# Altium schematic sheet BLOCK_DIAGRAM.SchDoc
size 393 x 281 mm; SheetNumber: 1; SheetTotal: 6
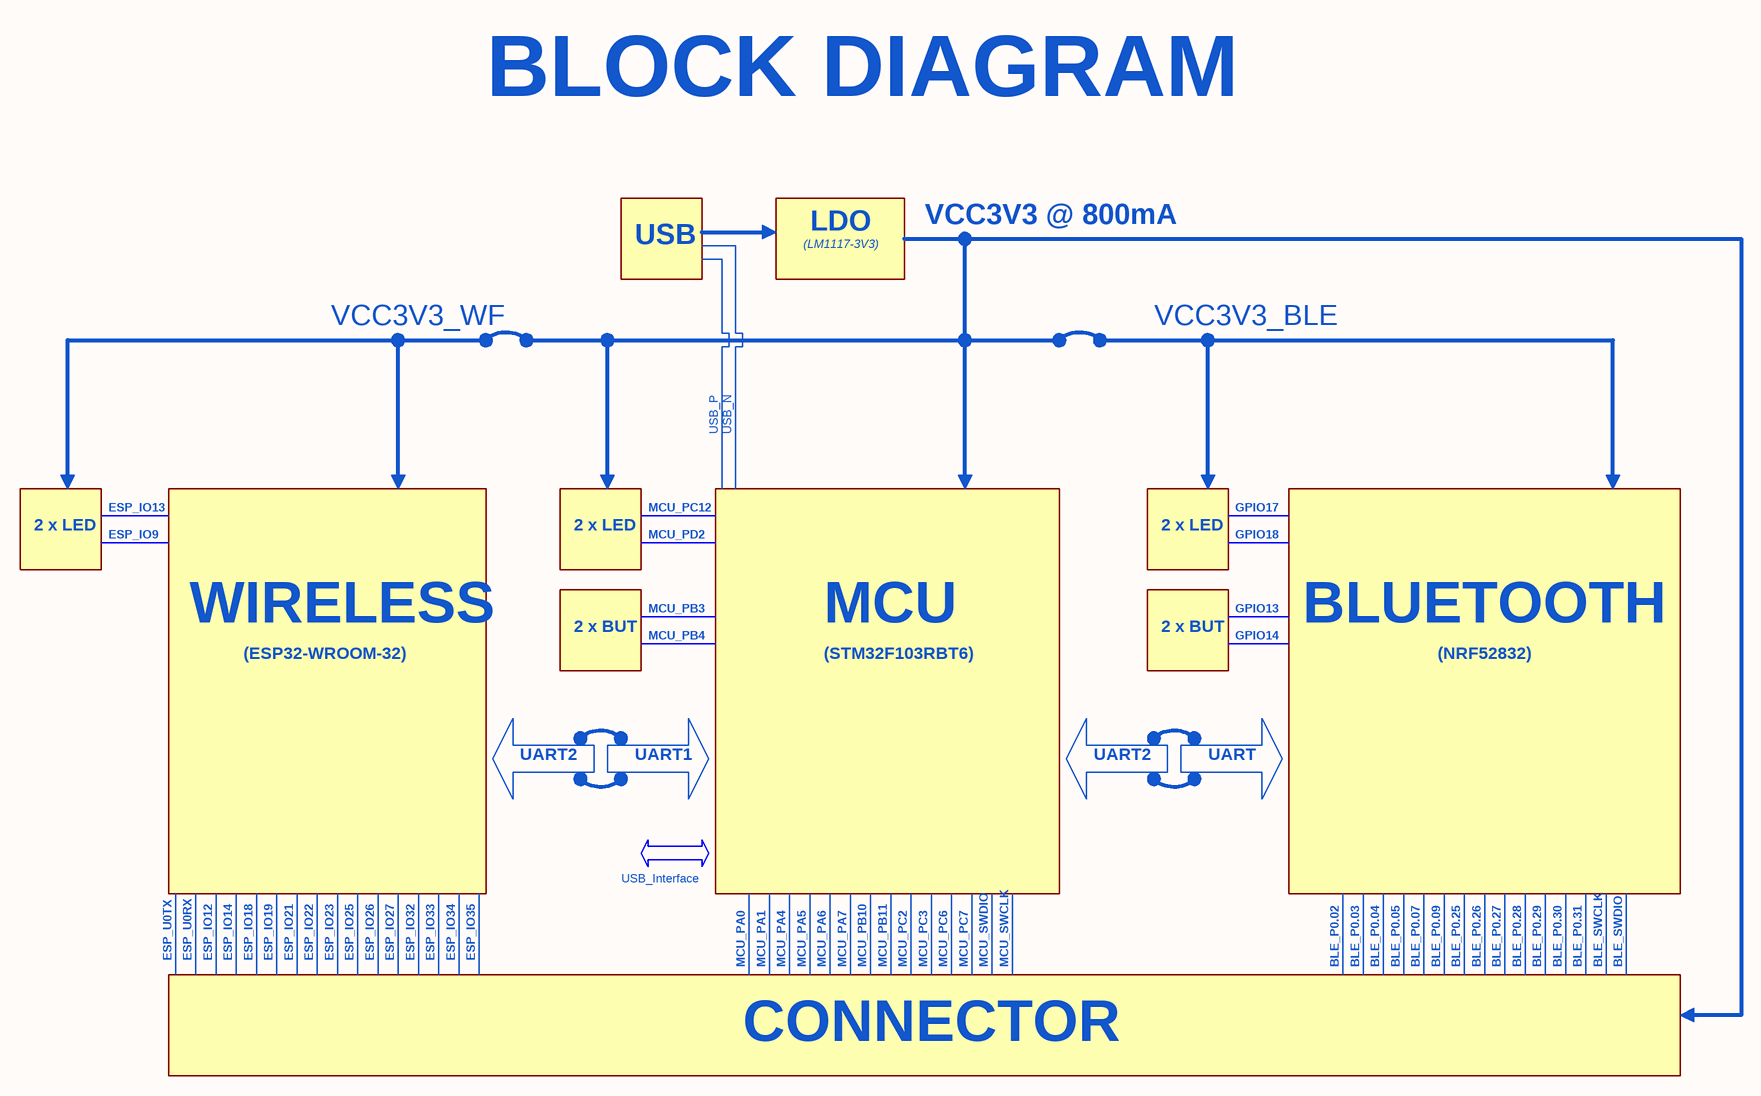
[diagram p0: BLOCK_DIAGRAM.SchDoc]

## Notes on the sheet
- BLOCK DIAGRAM
- LDO
- VCC3V3 @ 800mA
- USB
- (LM1117-3V3)
- VCC3V3_WF
- VCC3V3_BLE
- USB_P
- USB_N
- ESP_IO13
- MCU_PC12
- GPIO17
- 2 x LED
- ESP_IO9
- MCU_PD2
- GPIO18
- WIRELESS
- 2 x BUT
- MCU_PB3
- MCU_PB4
- MCU
- GPIO13
- GPIO14
- BLUETOOTH
- (ESP32-WROOM-32)
- (STM32F103RBT6)
- (NRF52832)
- UART2
- UART1
- UART
- USB_Interface
- ESP_U0TX
- ESP_U0RX
- ESP_IO12
- ESP_IO14
- ESP_IO18
- ESP_IO19
- ESP_IO21
- ESP_IO22
- ESP_IO23
- ESP_IO25
- ESP_IO26
- ESP_IO27
- ESP_IO32
- ESP_IO33
- ESP_IO34
- ESP_IO35
- MCU_PA0
- MCU_PA1
- MCU_PA4
- MCU_PA5
- MCU_PA6
- MCU_PA7
- MCU_PB10
- MCU_PB11
- MCU_PC2
- MCU_PC3
- MCU_PC6
- MCU_PC7
- MCU_SWDIO
- MCU_SWCLK
- BLE_P0.02
- BLE_P0.03
- BLE_P0.04
- BLE_P0.05
- BLE_P0.07
- BLE_P0.09
- BLE_P0.25
- BLE_P0.26
- BLE_P0.27
- BLE_P0.28
- BLE_P0.29
- BLE_P0.30
- BLE_P0.31
- BLE_SWCLK
- BLE_SWDIO
- CONNECTOR
- Title:
- Size:
- A3
- Date Modified:
- Document Number:
- Rev:
- Engineer:
- Sheet
- Of